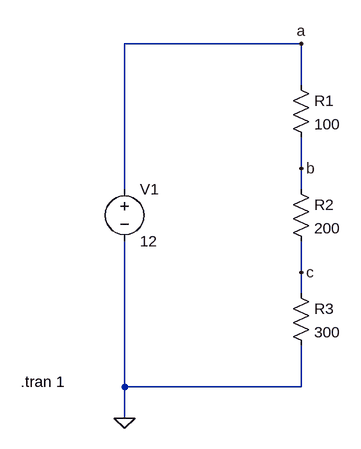
[diagram p0: schematic lab2.asc]
lab2.asc, the LTspice schematic file:
Version 4
SHEET 1 880 680
WIRE 304 -96 32 -96
WIRE 304 -32 304 -96
WIRE 304 96 304 48
WIRE 32 128 32 -96
WIRE 304 128 304 96
WIRE 304 256 304 208
WIRE 304 288 304 256
WIRE 32 432 32 208
WIRE 304 432 304 368
WIRE 304 432 32 432
WIRE 32 480 32 432
FLAG 304 -96 a
FLAG 304 96 b
FLAG 304 256 c
FLAG 32 480 0
SYMBOL voltage 32 112 R0
WINDOW 123 0 0 Left 0
WINDOW 39 0 0 Left 0
SYMATTR InstName V1
SYMATTR Value 12
SYMBOL res 288 -48 R0
SYMATTR InstName R1
SYMATTR Value 100
SYMBOL res 288 112 R0
SYMATTR InstName R2
SYMATTR Value 200
SYMBOL res 288 272 R0
SYMATTR InstName R3
SYMATTR Value 300
TEXT -128 424 Left 2 !.tran 1

The netlist it stands for:
* lab2.asc
V1 a 0 12
R1 a b 100
R2 b c 200
R3 c 0 300
.tran 1
.backanno
.end